# Altium schematic sheet PCB_LED_CALENDAR__POWER.SchDoc
size A4
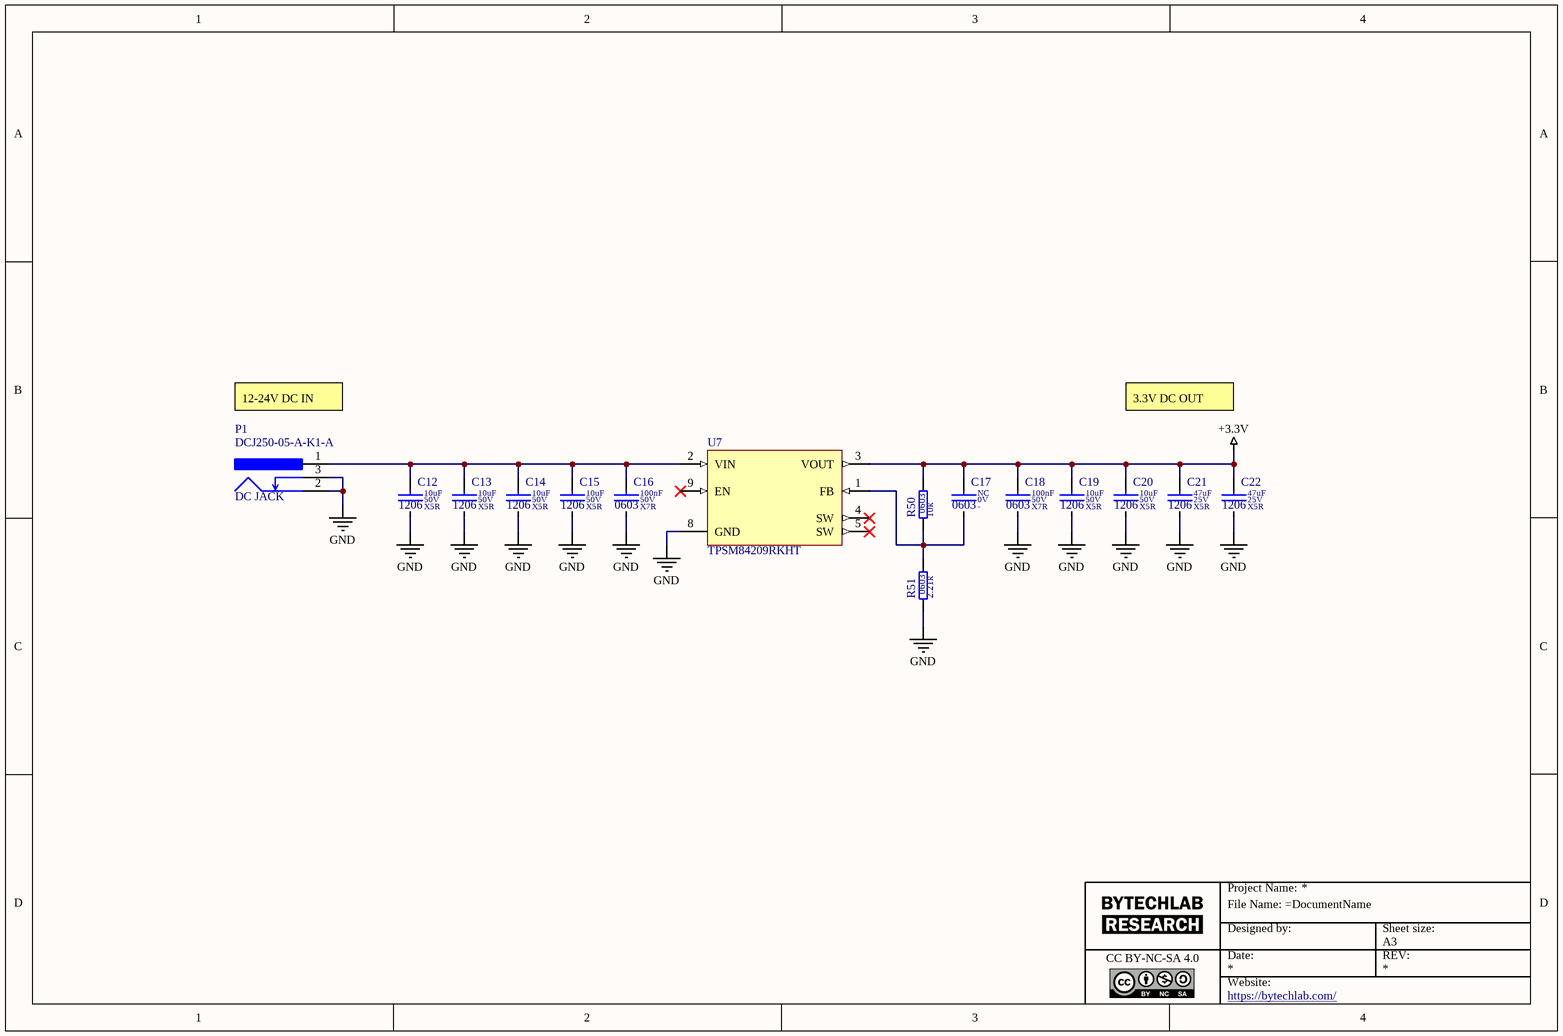
[diagram p0: PCB_LED_CALENDAR__POWER.SchDoc]

## Parts
C12  value 10uF  Dielectric: X5R  Voltage: 50V  SCH_Footprint: 1206  [C_1206_3216]  (hidden comment: Ceramic X5R)
C13  value 10uF  Dielectric: X5R  Voltage: 50V  SCH_Footprint: 1206  [C_1206_3216]  (hidden comment: Ceramic X5R)
C14  value 10uF  Dielectric: X5R  Voltage: 50V  SCH_Footprint: 1206  [C_1206_3216]  (hidden comment: Ceramic X5R)
C15  value 10uF  Dielectric: X5R  Voltage: 50V  SCH_Footprint: 1206  [C_1206_3216]  (hidden comment: Ceramic X5R)
C16  value 100nF  Dielectric: X7R  Voltage: 50V  SCH_Footprint: 0603  [C_0603_1608]  (hidden comment: Ceramic X7R)
C17  value NC  Voltage: 0V  SCH_Footprint: 0603  [C_NC_0603_1608]  (hidden comment: -)
C18  value 100nF  Dielectric: X7R  Voltage: 50V  SCH_Footprint: 0603  [C_0603_1608]  (hidden comment: Ceramic X7R)
C19  value 10uF  Dielectric: X5R  Voltage: 50V  SCH_Footprint: 1206  [C_1206_3216]  (hidden comment: Ceramic X5R)
C20  value 10uF  Dielectric: X5R  Voltage: 50V  SCH_Footprint: 1206  [C_1206_3216]  (hidden comment: Ceramic X5R)
C21  value 47uF  Dielectric: X5R  Voltage: 25V  SCH_Footprint: 1206  [C_1206_3216]  (hidden comment: Ceramic X5R)
C22  value 47uF  Dielectric: X5R  Voltage: 25V  SCH_Footprint: 1206  [C_1206_3216]  (hidden comment: Ceramic X5R)
P1  value DCJ250-05-A-K1-A  SCH_Footprint: DC JACK  [P_DCJ250-05-A-K1-A]  (hidden comment: DC Power Connectors DC Power Jack, SMT, Horizontal, with pegs)
R50  value 10k  SCH_Footprint: 0603  [R_0603_1608]  (hidden comment: Resistor)
R51  value 2.21k  SCH_Footprint: 0603  [R_0603_1608]  (hidden comment: Resistor)
U7  TPSM84209RKHT  [QFN9_4.5x4]

## Nets
+3.3V: C17.1 C18.1 C19.1 C20.1 C21.1 C22.1 R50.2 U7.3(VOUT)
GND: C12.2 C13.2 C14.2 C15.2 C16.2 C18.2 C19.2 C20.2 C21.2 C22.2 P1.2 P1.3 R51.1 U7.8(GND)
NetC12_1: C12.1 C13.1 C14.1 C15.1 C16.1 P1.1 U7.2(VIN)
NetC17_2: C17.2 R50.1 R51.2 U7.1(FB)

Not connected (* = marked no-connect by the designer): U7 4(SW)* 5(SW)* 6(DNC) 7(DNC) 9(EN)*

## Notes on the sheet
- 12-24V DC IN
- 3.3V DC OUT
- Project Name:
- File Name: =DocumentName
- CC BY-NC-SA 4.0
- Designed by:
- Date:
- Website:
- Sheet size:
- A3
- REV:
- https://bytechlab.com/

## Library data of the parts
C12-C15 C19 C20 = C_10uF_50V_X5R_1206_10: Capacitor; Manufacturer: Murata; Manufacturer Part Number: GRT31CR61H106KE01L; Tolerance (%): 10; Part Number: C_10uF_50V_X5R_1206_10; HelpURL: https://www.mouser.pl/datasheet/2/281/1/GRT31CR61H106KE01_01A-3158417.pdf; Supplier 1: TME; Supplier Part Number 1: GRT31CR61H106KE01L; Supplier 2: RS Components; Supplier Part Number 2: 1656426; Supplier 3: Farnell; Supplier Part Number 3: 2672214; Supplier 4: Mouser; Supplier Part Number 4: 81-GRT31CR61H106KE1L; Supplier 5: Digi-Key; Supplier Part Number 5: 490-12456-1-ND; Supplier 6: LCSC
C16 C18 = C_100nF_50V_X7R_0603_5: Capacitor; Manufacturer: Samsung; Manufacturer Part Number: CL10B104JB8NNNC; Tolerance (%): 5; Part Number: C_100nF_50V_X7R_0603_5; HelpURL: http://www.tme.eu/pl/Document/4a42202b32dab16128fe107dd69598cc/samsung-chip-cap.pdf; Supplier 1: TME; Supplier Part Number 1: CL10B104JB8NNNC; Supplier 2: RS Components; Supplier Part Number 2: 7665455; Supplier 3: Farnell; Supplier 4: Mouser; Supplier 5: Digi-Key; Supplier Part Number 5: 1276-1033-1-ND; Supplier 6: LCSC; Supplier Part Number 6: C24452
C17 = C_GENERIC_0603: Capacitor; Tolerance (%): 0; Dielectric: -; Part Number: C_GENERIC_0603; HelpURL: -; Manufacturer: -; Manufacturer Part Number: -; Supplier 1: TME; Supplier 2: RS Components; Supplier 3: Farnell; Supplier 4: Mouser; Supplier 5: Digi-Key; Supplier 6: LCSC
C21 C22 = C_47uF_25V_X5R_1206_20: Capacitor; Manufacturer: TDK; Manufacturer Part Number: C3216X5R1E476M160AC; Tolerance (%): 20; Part Number: C_47uF_25V_X5R_1206_20; HelpURL: https://product.tdk.com/system/files/dam/doc/product/capacitor/ceramic/mlcc/catalog/mlcc_commercial_general_en.pdf; Supplier 1: TME; Supplier Part Number 1: C3216X5R1E476MAC; Supplier 2: RS Components; Supplier Part Number 2: 7883060P; Supplier 3: Farnell; Supplier Part Number 3: 2525172; Supplier 4: Mouser; Supplier Part Number 4: 810-C3216X5R1E476M; Supplier 5: Digi-Key; Supplier Part Number 5: 445-8047-1-ND; Supplier 6: LCSC
P1 = P_DCJ250-05-A-K1-A: Typical 3-pin jack power connector with switch; Manufacturer: GCT; Part Number: P_DCJ250-05-A-K1-A; HelpURL: https://gct.co/files/drawings/dcj250-05.pdf?v=cff2b182-97b3-411d-910e-e1786ab477e1; Manufacturer Part Number: DCJ250-05-A-K1-A; Supplier 1: TME; Supplier Part Number 1: DCJ250-05-A-K1-A; Supplier 2: RS Components; Supplier 3: Farnell; Supplier Part Number 3: 3873256; Supplier 4: Mouser; Supplier Part Number 4: 640-DCJ250-05-A-K1-A; Supplier 5: Digi-Key; Supplier Part Number 5: 2073-DCJ250-05-A-K1-ACT-ND; Supplier 6: LCSC
R50 = R_10k_0603_1: Manufacturer: Vishay; Manufacturer Part Number: CRCW060310K0FKTA; Voltage: 75V; Power: 100mW; Tolerance: 1%; Part Number: R_10k_0603_1; HelpURL: https://octopart.com/datasheet/crcw060310k0fkta-vishay-39447548; Supplier 1: TME; Supplier Part Number 1: CRCW060310K0FKTABC; Supplier 2: RS Components; Supplier 3: Farnell; Supplier Part Number 3: 1652827; Supplier 4: Mouser; Supplier Part Number 4: 71-CRCW0603-10K; Supplier 5: Digi-Key; Supplier Part Number 5: 541-2980-1-ND; Supplier 6: LCSC
R51 = R_2.21k_0603_0.1: Manufacturer: Vishay; Manufacturer Part Number: RV0603E2211BNT; Voltage: 50V; Power: 125mW; Tolerance: 0.1%; Part Number: R_2.21k_0603_0.1; HelpURL: https://datasheet.octopart.com/RV0603E2211BNT-Vishay-datasheet-17360820.pdf; Supplier 1: TME; Supplier 2: RS Components; Supplier 3: Farnell; Supplier Part Number 3: 2352724; Supplier 4: Mouser; Supplier 5: Digi-Key; Supplier Part Number 5: 716-RV0603E2211BNTTR-ND; Supplier 6: LCSC
U7 = VS_TPSM84209RKHT: 4.5-V to 28-V Input, 1.2-V to 6-V Output, 2.5-A Power Module; Manufacturer: Texas Instruments; Manufacturer Part Number: TPSM84209RKHT; Supplier 1: *; Supplier Part Number 1: *